# Altium project layout_test_master.PrjPcb
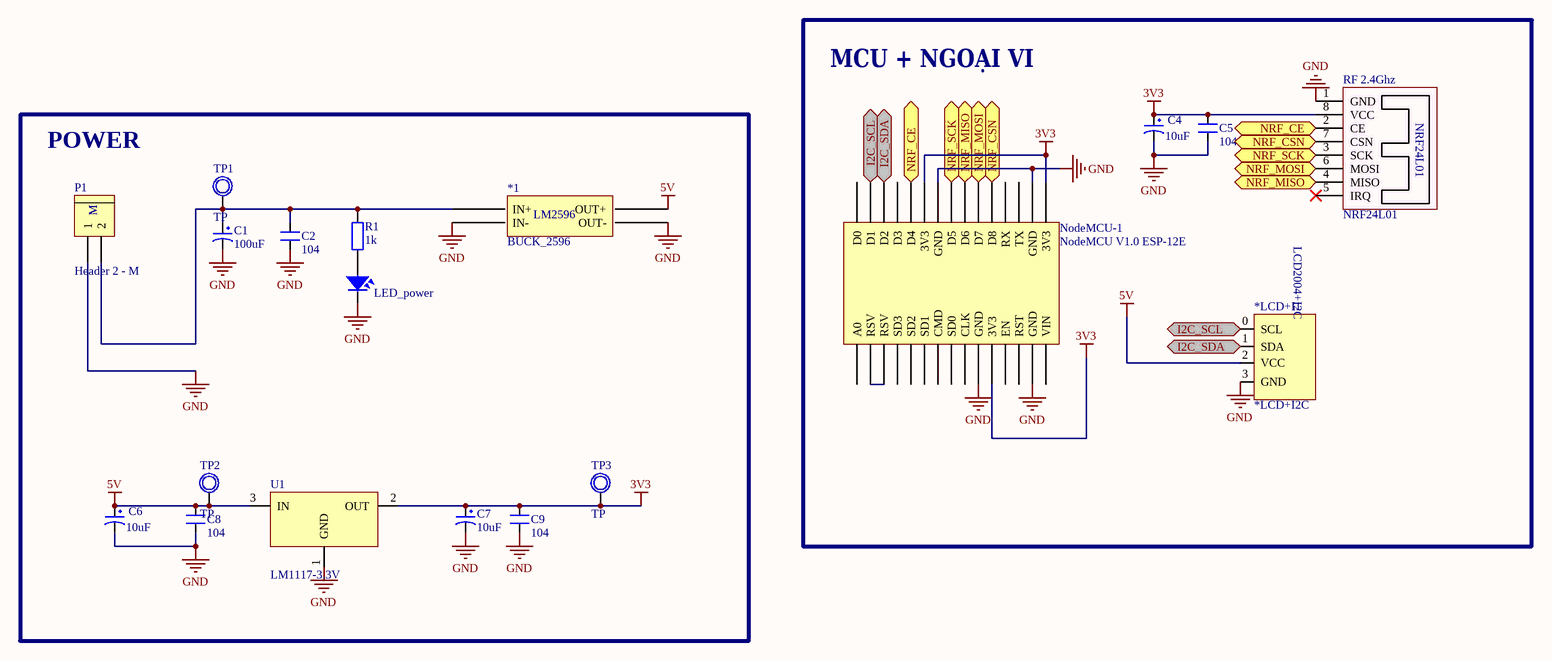
[diagram p0: layout_test_master.SchDoc]
1 sheet, 19 parts. Net scope: flat (ports and power ports of the same name join across sheets).
Board file: layout_test_master.PcbDoc

## Sheet layout_test_master.SchDoc
size B

### Parts
*1  BUCK_2596  [BUCK_2596]
*LCD+I1  *LCD+I2C  [LCD2004+I2C]
C1  100uF  [CP1/2.5]
C2  104  [SM-CAP-0805]
C4  10uF  [CP1/2]
C5  104  [SM-CAP-0805]
C6  10uF  [CP1/2]
C7  10uF  [CP1/2]
C8  104  [SM-CAP-0805]
C9  104  [SM-CAP-0805]
LED_power  LED  [LED-5-BLUE]  (value not drawn)
NodeMCU-1  NodeMCU V1.0 ESP-12E  [NodeMCU V1.0 ESP-12E]
P1  Header 2 - M  [Medium - Header 2]
R1  1k  [R1/4W]
RF_2.4Ghz  NRF24L01  [NRF24L01A]
TP1  TP  [TP1]
TP2  TP  [TP1]
TP3  TP  [TP1]
U1  LM1117-3.3V  [SOT223]

### Ports
I2C_SCL, I2C_SDA, NRF_CE, NRF_CSN, NRF_MISO, NRF_MOSI, NRF_SCK

### Nets
3V3: C4.1 C5.2 C7.1 C9.2 NodeMCU-1.3V3 RF_2.4Ghz.8(VCC) TP3.1 U1.2(OUT)
5V: *1.4(OUT+) *LCD+I1.2(VCC) C6.1 C8.2 TP2.1 U1.3(IN)
GND: *1.2(IN-) *1.3(OUT-) *LCD+I1.3(GND) C1.2 C2.1 C4.2 C5.1 C6.2 C7.2 C8.1 C9.1 LED_power.2 NodeMCU-1.GND P1.1 RF_2.4Ghz.1(GND) U1.1(GND)
Net*1_1: *1.1(IN+) C1.1 C2.2 P1.2 R1.2 TP1.1
Net*LCD+I1_0: *LCD+I1.0(SCL) NodeMCU-1.D1 ; port I2C_SCL
Net*LCD+I1_1: *LCD+I1.1(SDA) NodeMCU-1.D2 ; port I2C_SDA
NetLED_power_1: LED_power.1 R1.1
NetNodeMCU-1_D4: NodeMCU-1.D4 RF_2.4Ghz.2(CE) ; port NRF_CE
NetNodeMCU-1_D5: NodeMCU-1.D5 RF_2.4Ghz.3(SCK) ; port NRF_SCK
NetNodeMCU-1_D6: NodeMCU-1.D6 RF_2.4Ghz.4(MISO) ; port NRF_MISO
NetNodeMCU-1_D7: NodeMCU-1.D7 RF_2.4Ghz.6(MOSI) ; port NRF_MOSI
NetNodeMCU-1_D8: NodeMCU-1.D8 RF_2.4Ghz.7(CSN) ; port NRF_CSN

Not connected (* = marked no-connect by the designer): NodeMCU-1 A0 CLK CMD D0 D3 EN RST RSV RX SD0 SD1 SD2 SD3 TX VIN; RF_2.4Ghz 5(IRQ)*

### Notes on the sheet
- MCU + NGOẠI VI
- POWER
- (in symbol BUCK_2596) LM2596
- (in symbol Header 2 - M) M
- (in symbol i2c+lcd2004) LCD2004+I2C

### Library data of the parts
*LCD+I1 = i2c+lcd2004
C1 = CP2: C 47uF/50V , 220uF/16V; Value: 47uF/16 - 50V; Description 1: 470uF/6,3V - 330uF/10V - 220uF/16V; Description 2: 100uF/25V - 35V - 47uF/50V - 22uF/100V; Description 3: 33uF => 47uF/63V - 1uF => 4,7uF/160V; Description 4: 1uF => 2,2uF/250V - 1uF/350V
C2 C5 C8 C9 = CN: Value: 0,1uF/300V; Designed by: VanDungEvn
C4 C6 C7 = CP1: Cap P  0,1uF < 22uF , 16 - 50V; Value: 10uF/50V; Description 1: 10 => 220uF/6,3V/10V - 10uF => 100uF/16V; Description 2: 0,1uF => 33uF/50V - 10uF => 22uF/63V; Description 3: 0,47uF => 10uF/100V
LED_power = LED: LED Single colour Green and Red; Value: LED 3 ly Single Colour
NodeMCU-1 = NodeMCU V1.0 ESP-12E: NodeMCU V1.0 ESP8266 (ESP-12E)
P1 = Header 2 - M: Header, 2-Pin, Medium; LatestRevisionDate: 17-Jul-2002; LatestRevisionNote: Re-released for DXP Platform.; Publisher: Altium Limited
R1 = R1/4W: Resistor 1/4W; Value: R1/4W - 1K
TP1-TP3 = TP1: Test Point; Value: Test Point
U1 = LM1117: 800mA Low-Dropout Linear Regulator; Creator: Nguyen Ba Bien; Website: http://group3i.net